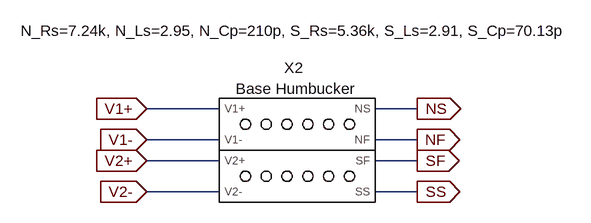
[diagram p0: schematic DiMarzio_Velorum_Neck_DP264F.asc]
DiMarzio_Velorum_Neck_DP264F.asc, the LTspice schematic file:
Version 4
SHEET 1 880 680
WIRE 96 448 -16 448
WIRE 400 448 336 448
WIRE 96 496 -16 496
WIRE 400 496 336 496
WIRE 96 528 -16 528
WIRE 400 528 336 528
WIRE 96 576 -16 576
WIRE 400 576 336 576
FLAG -16 448 V1+
IOPIN -16 448 In
FLAG -16 496 V1-
IOPIN -16 496 In
FLAG -16 528 V2+
IOPIN -16 528 In
FLAG -16 576 V2-
IOPIN -16 576 In
FLAG 400 448 NS
IOPIN 400 448 Out
FLAG 400 496 NF
IOPIN 400 496 Out
FLAG 400 528 SF
IOPIN 400 528 Out
FLAG 400 576 SS
IOPIN 400 576 Out
SYMBOL Base_Humbucker 208 512 R0
WINDOW 39 5 -168 Bottom 2
SYMATTR SpiceLine N_Rs=7.24k, N_Ls=2.95, N_Cp=210p, S_Rs=5.36k, S_Ls=2.91, S_Cp=70.13p
SYMATTR InstName X2

The netlist it stands for:
* DiMarzio_Velorum_Neck_DP264F.asc
XX2 V1+ V1- V2+ V2- NF NS SF SS Base Humbucker N_Rs=7.24k, N_Ls=2.95, N_Cp=210p, S_Rs=5.36k, S_Ls=2.91, S_Cp=70.13p  ; pins V1+ V1- V2+ V2- NF NS SF SS
.backanno
.end